# Altium schematic sheet power.SchDoc: Power
size Letter; Organization: PulseOut COVID; Address1: By: N. Petrunyak; Address2: pulseoutcovid.com; DocumentNumber: 1; Revision: 0; SheetNumber: 4; SheetTotal: 5
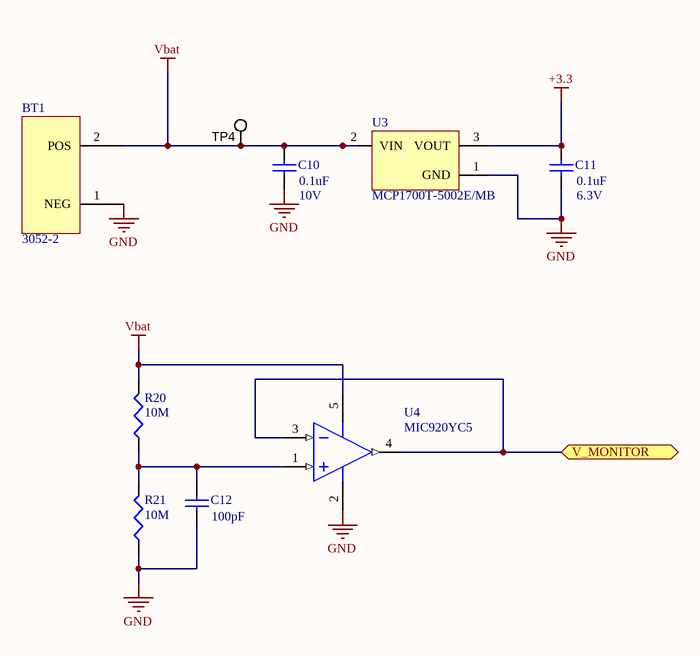
[diagram p0: power.SchDoc]

## Parts
BT1  3052-2  [3025-2]
C10  value 0.1uF  Voltage: 10V  [1608[0603]]  (hidden comment: Cap Semi)
C11  value 0.1uF  Voltage: 6.3V  [1608[0603]]  (hidden comment: Cap Semi)
C12  value 100pF  [0603]  (hidden comment: Cap Semi)
R20  value 10M  [J1-0603]  (hidden comment: Res3)
R21  value 10M  [J1-0603]  (hidden comment: Res3)
TP4  5002  [Keystone5002]  (value not drawn)
U3  MCP1700T-5002E/MB  [SOT-89-MB3_N]
U4  MIC920YC5  [X5+1_L]

## Ports
V_MONITOR (bidir)

## Nets
+3.3: C11.2 U3.3(VOUT)
GND: BT1.1(NEG) C10.1 C11.1 C12.1 R21.1 U3.1(GND) U4.2(VSS)
Vbat: BT1.2(POS) C10.2 R20.2 TP4.1 U3.2(VIN) U4.5(VDD)
V_MONITOR: U4.3(IN-) U4.4(OUT) ; port V_MONITOR
NetC12_2: C12.2 R20.1 R21.2 U4.1(IN+)

## Notes on the sheet
- Title
- Size:
- Date:
- Letter
- Number:
- Time:
- Revision:
- Sheet
- of
- File:

## Library data of the parts
BT1 = 3025-2: BATTERY RETNR COIN 2 CELL PC PIN; Mfr 1: Keystone Electronics; Mfr 1 PN: 3025-2; DigiKey: 36-3025-2-ND; MPN: 3025-2; Manufacturer: Keystone Electronics
C10 = Cap Semi: Capacitor (Semiconductor SIM Model); MPN: 0603ZC104KAT2A; Manufacturer: AVX Corporation; Published: 8-Jun-2000; LatestRevisionDate: 29-May-2009; LatestRevisionNote: IPC-7351 Footprint Added.; PackageReference: C1206; Publisher: Altium Limited; PackageDescription: Chip Capacitor; DigiKey: 478-7939-6-ND
C11 = Cap Semi: Capacitor (Semiconductor SIM Model); MPN: 06036C104KAT4A; Manufacturer: AVX Corporation; Published: 8-Jun-2000; LatestRevisionDate: 29-May-2009; LatestRevisionNote: IPC-7351 Footprint Added.; PackageReference: C1206; Publisher: Altium Limited; PackageDescription: Chip Capacitor; DigiKey: 478-06036C104KAT4ACT-ND
C12 = Cap Semi: Capacitor (Semiconductor SIM Model); MPN: 0603ZC101KAT2A; Manufacturer: AVX Corporation; Published: 8-Jun-2000; LatestRevisionDate: 29-May-2009; LatestRevisionNote: IPC-7351 Footprint Added.; PackageReference: 0603; Publisher: Altium Limited; PackageDescription: Chip Capacitor; DigiKey: 478-11846-1-ND
R20 R21 = Res3: Resistor; MPN: ERJ-3GEYJ106V; Manufacturer: Panasonic; Published: 8-Jun-2000; LatestRevisionDate: 29-May-2009; LatestRevisionNote: IPC-7351 Footprint Added.; PackageReference: J1-0603; Publisher: Altium Limited; PackageDescription: Chip Resistor; DigiKey: P10MGCT-ND
TP4 = 5002: Test Point, Miniature, White, TH; Manufacturer: Keystone; CompType: Test Point Loop; U/M: EA; SymbolVersion: 2008-04-04; PartNumber: 5002; PackageReference: White Miniature Testpoint; RoHS: Y; MountType: TH; ComponentLink1Description: Datasheet Link; ComponentLink1URL: http://www.keyelco.com/userAssets/file/M60-2p60.pdf; Value: White; Publisher: Texas Instruments; LatestRevisionDate: 2015-08-25; Supplier 1: Digi-Key; DigiKey: 36-5002-ND; Supplier 2: Newark; Supplier Part Number 2: 82H9632; MPN: 5002
U3 = CMP-0136-00868-1: Low Quiescent Current LDO, 3-Pin SOT-89, Extended Temperature, Tape and Reel; Manufacturer: Microchip; PackageDescription: 3-Lead Plastic Small Outline Transistor Header (MB) [SOT-89]; Code_IPC: SOT89; DatasheetVersion: revB, Feb-2007; PackageVersion: revBB, Aug-2009; PackageReference: SOT-89-MB3; DigiKey: MCP1700T5002EMBCT-ND; MPN: MCP1700T-5002E/MB
U4 = CMP-0252-00510-1: High-Output-Drive, Rail-to-Rail I/O Op Amps with Shutdown, 10 MHz, 10 V/us, 2.7 to 5.5 V, -40 to 125 degC, 5-Pin SC70 (X5+1), RoHS, Tape and Reel; Manufacturer: Microchip; PartNumber: MIC920YC5-TR; Gain Bandwidth: 80 MHz Typ.; VDD: 2.5 to 9 V; ComponentLink2URL: http://ww1.microchip.com/downloads/en/DeviceDoc/MIC920-80MHz-Low-Power-SC70-Op-Amp-DS20006268A.pdf; RoHS: TRUE; Packing: Tape and Reel; Mounting Technology: Surface Mount; Temperature Range: -40 to 125 degC; ComponentLink2Description: Datasheet; DigiKey: 576-4560-1-ND; MPN: MIC920YC5-TR